# Altium schematic sheet 02_Power.SchDoc
size A4; SheetNumber: 2; SheetTotal: 8
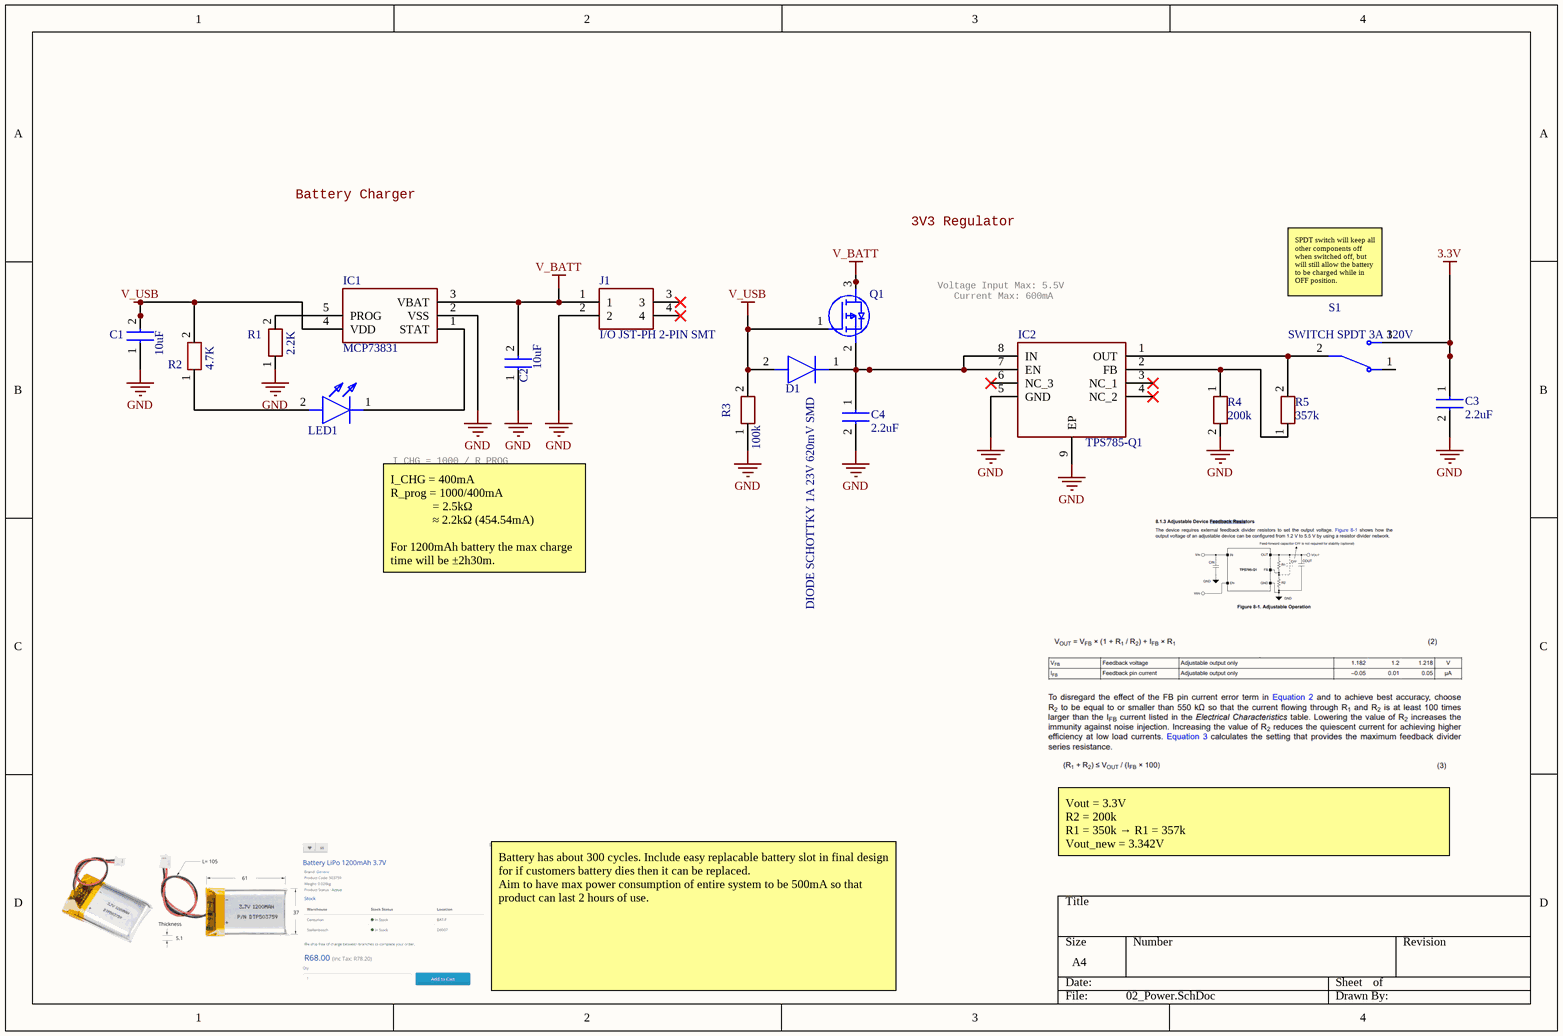
[diagram p0: 02_Power.SchDoc]

## Parts
C1  10uF  [CAPC2012X94N]
C2  10uF  [CAPC2012X94N]
C3  2.2uF  [CAPC2012X135N]
C4  2.2uF  [CAPC2012X135N]
D1  DIODE SCHOTTKY 1A 23V 620mV SMD  [SOD2512X113N]
IC1  MCP73831  [SOT95P270X145-5N]
IC2  TPS785-Q1  [SON65P300X300X100-9N-D]
J1  I/O JST-PH 2-PIN SMT  [1769]
LED1  LED YELLOW 0805 SMD  [LYM676Q2S126Z]  (value not drawn)
Q1  MOSFET P-CH ENH FET -20V 52mOh -5A SMD  [SOT96P240X115-3N]  (value not drawn)
R1  2.2K  [RESC2012X70N]
R2  4.7K  [RESC2012X50N]
R3  100k  [RESC2012X50N]
R4  200k  [RESC2012X60N]
R5  357k  [ERJ6ENF1000V]
S1  SWITCH SPDT 3A 120V  [SW_500ASSP1M6QE]

## Nets
3.3V: C3.1 S1.3(NO)
GND: C1.1 C2.1 C3.2 C4.2 IC1.2(VSS) IC2.5(GND) IC2.9(EP) J1.2 R1.1 R3.1 R4.2
V_BATT: C2.2 IC1.3(VBAT) J1.1 Q1.3(D)
V_USB: C1.2 D1.2(A) IC1.4(VDD) Q1.1(G) R2.2 R3.2
NetC4_1: C4.1 D1.1(K) IC2.7(EN) IC2.8(IN) Q1.2(S)
NetIC1_1: IC1.1(STAT) LED1.1(K)
NetIC1_5: IC1.5(PROG) R1.2
NetIC2_1: IC2.1(OUT) R5.2 S1.2(COM)
NetIC2_2: IC2.2(FB) R4.1 R5.1
NetLED1_2: LED1.2(A) R2.1

Not connected (* = marked no-connect by the designer): IC2 3(NC_1)* 4(NC_2)* 6(NC_3)*; J1 3* 4*; S1 1(NC)

## Notes on the sheet
- Battery Charger
- 3V3 Regulator
- Voltage Input Max: 5.5V
  Current Max: 600mA
- (near S1) SPDT switch will keep all other components off when switched off, but will still allow the battery to be charged while in OFF position.
- (near LED1) I_CHG = 1000 / R_PROG
- I_CHG = 400mA
  R_prog = 1000/400mA
  = 2.5kΩ
  ≈ 2.2kΩ (454.54mA)
  For 1200mAh battery the max charge time will be ±2h30m.
- Vout = 3.3V
  R2 = 200k
  R1 = 350k → R1 = 357k
  Vout_new = 3.342V
- Battery has about 300 cycles. Include easy replacable battery slot in final design for if customers battery dies then it can be replaced.
  Aim to have max power consumption of entire system to be 500mA so that product can last 2 hours of use.

## Library data of the parts
C1 C2 = CAP CER 10uF 0805 SMD: Capacitor; Manufacturer_Part_Number: CL21A106KOQNNNE; ComponentLink1Description: Datasheet; ComponentLink1URL: https://www.mouser.co.za/datasheet/2/585/MLCC-1837944.pdf
C3 C4 = CAP CER 2u2F 0805 SMD: Capacitor; Manufacturer_Part_Number: LMK212BJ225MG-T
D1 = DIODE SCHOTTKY 1A 23V 620mV SMD: Diode; Manufacturer_Part_Number: BAT20JFILM; ComponentLink1Description: Datasheet; ComponentLink1URL: http://www.st.com/web/en/resource/technical/document/datasheet/CD00012201.pdf
IC1 = IC BATT CHG MGNT Li-Po 4V2 REG SMD: Integrated Circuit; Manufacturer_Part_Number: MCP73831T-2ACI/OT; ComponentLink1Description: Datasheet; ComponentLink1URL: http://ww1.microchip.com/downloads/en/DeviceDoc/20001984g.pdf
IC2 = IC LDO 1A 5V5 ADJ SMD SON-8: LDO Voltage Regulators Automotive 1-A high -accuracy adjustable; Manufacturer_Part_Number: TPS78501QWDRBRQ1; ComponentLink1Description: Datasheet; ComponentLink1URL: https://www.ti.com/lit/gpn/TPS785-Q1
J1 = I/O JST-PH 2-PIN SMT: Connector; Manufacturer_Part_Number: 1769
LED1 = LED YELLOW 0805 SMD: Single Colour LED Yellow 20mA; Manufacturer_Part_Number: LY M676-Q2S1-26-Z; ComponentLink1Description: Datasheet; ComponentLink1URL: https://www.mouser.com/datasheet/2/588/Osram_7222021_LY__M676_EN-2891431.pdf
Q1 = MOSFET P-CH ENH FET -20V 52mOh -5A SMD: MOSFET (P-Channel); Manufacturer_Part_Number: DMG2305UX-7; ComponentLink1Description: Datasheet; ComponentLink1URL: https://www.diodes.com/assets/Datasheets/DMG2305UX.pdf
R1 = RES 2.2K 0805 SMD: Resistor; Manufacturer_Part_Number: ERJ-PB6B2201V
R2 = RES 4.7K 0805 SMD: Resistor; Manufacturer_Part_Number: CRCW08054K70FKEA
R3 = RES 100K 0805 SMD: Resistor; Manufacturer_Part_Number: CRCW0805100KJNECC
R4 = RES 200K 0805 SMD: Resistor; Manufacturer_Part_Number: SG73P2ATTD2003F
R5 = RES 357K 0805 SMD: Resistor; Manufacturer_Part_Number: ERJ-6ENF3573V; ComponentLink1Description: Datasheet; ComponentLink1URL: https://industrial.panasonic.com/cdbs/www-data/pdf/RDA0000/AOA0000C84.pdf
S1 = SWITCH SPDT 3A 120V: Manufacturer_Part_Number: 500ASSP1M6QE